# Altium schematic sheet Bias_Current_Source.SchDoc
size 228 x 152 mm
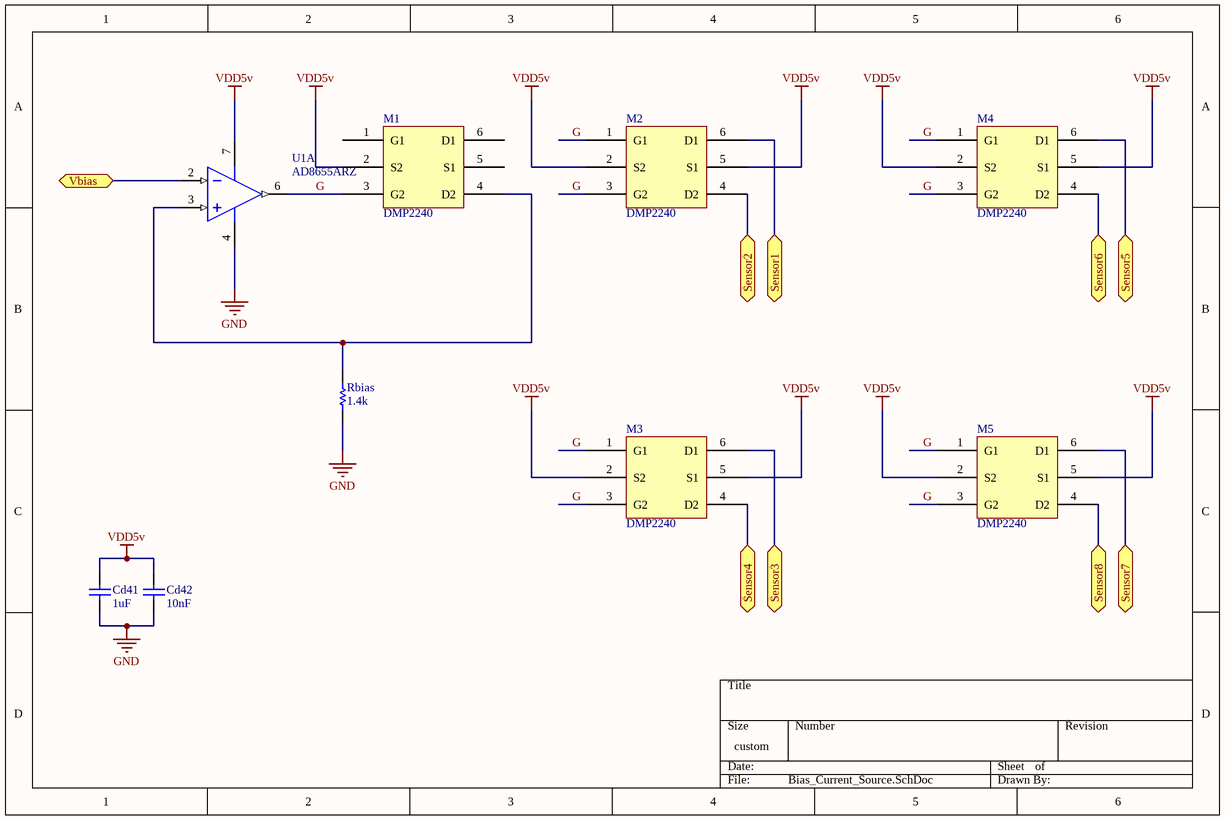
[diagram p0: Bias_Current_Source.SchDoc]

## Parts
Cd41  value 1uF  [1608[0603]]  (hidden comment: Cap)
Cd42  value 10nF  [1608[0603]]  (hidden comment: Cap)
M1  DMP2240  [SO-G6/E2.4]
M2  DMP2240  [SO-G6/E2.4]
M3  DMP2240  [SO-G6/E2.4]
M4  DMP2240  [SO-G6/E2.4]
M5  DMP2240  [SO-G6/E2.4]
Rbias  value 1.4k  [1608[0603]]  (hidden comment: Res1)
U1  AD8655ARZ  [ADI-R-8_N]  (part A of 2)

## Ports
Sensor1 (bidir), Sensor2 (bidir), Sensor3 (bidir), Sensor4 (bidir), Sensor5 (bidir), Sensor6 (bidir), Sensor7 (bidir), Sensor8 (bidir), Vbias (bidir)

## Nets
GND: Cd41.2 Cd42.2 Rbias.2 U1.4(-V)
VDD5v: Cd41.1 Cd42.1 M1.2(S2) M2.2(S2) M2.5(S1) M3.2(S2) M3.5(S1) M4.2(S2) M4.5(S1) M5.2(S2) M5.5(S1) U1.7(+V)
G: M1.3(G2) M2.1(G1) M2.3(G2) M3.1(G1) M3.3(G2) M4.1(G1) M4.3(G2) M5.1(G1) M5.3(G2) U1.6(OUT)
Sensor1: M2.6(D1) ; port Sensor1
Sensor2: M2.4(D2) ; port Sensor2
Sensor3: M3.6(D1) ; port Sensor3
Sensor4: M3.4(D2) ; port Sensor4
Sensor5: M4.6(D1) ; port Sensor5
Sensor6: M4.4(D2) ; port Sensor6
Sensor7: M5.6(D1) ; port Sensor7
Sensor8: M5.4(D2) ; port Sensor8
Vbias: U1.2(-IN) ; port Vbias
NetM1_4: M1.4(D2) Rbias.1 U1.3(+IN)

Not connected (* = marked no-connect by the designer): M1 1(G1) 5(S1) 6(D1)

## Library data of the parts
Cd41 Cd42 = Cap: Capacitor; Published: 8-Jun-2000; LatestRevisionDate: 17-Jul-2002; LatestRevisionNote: Re-released for DXP Platform.; PackageReference: RAD-0.3; Publisher: Altium Limited; PackageDescription: Radial Cap, Thru-Hole; 2 Leads; 0.3 in Pin Spacing; Digi-Key: 445-7534-1-ND
Rbias = Res1: Resistor; Published: 8-Jun-2000; LatestRevisionDate: 17-Jul-2002; LatestRevisionNote: Re-released for DXP Platform.; PackageReference: AXIAL-0.3; Publisher: Altium Limited; PackageDescription: Axial Device, Thru-Hole; 2 Leads; 0.3 in Pin Spacing; Digikey PN: P1.00KCCT-ND
U1 = AD8655ARZ: Single Channel Low Offset Voltage Operational Amplifier, 28 MHz BW, 11 V/us SR, Industrial, 8-pin SOIC (R-8), Tube; Generic Part Number: AD8655; Manufacturer: Analog Devices; Amplifiers Per Package: 1; Input Bias Current: 1pA; Input Offset Voltage: 50uV; Iq/Amp: 4.5mA; Slew Rate: 11V/us; Small Signal Bandwidth: 28MHz; V Span Max: 5.5V; V Span Min: 2.7V; DatasheetVersion: Rev. B; PackageVersion: 060506-A; PackageReference: R-8; PackageDescription: 8-Pin Standard Small Outline Package, Body 3.9 x 4.9 mm, Pitch 1.27 mm; Supplier 1: Digi-Key; Supplier Part Number 1: AD8655ARZ-ND; Supplier 2: Newark; Supplier Part Number 2: 59K7052; Mounting Technology: Surface Mount; Code_JEDEC: MS-012-AA; PartNumber: AD8655ARZ; ComponentLink1Description: Manufacturer URL; ComponentLink1URL: http://www.analog.com/en/index.html; ComponentLink2Description: Datasheet; ComponentLink2URL: http://www.analog.com/static/imported-files/data_sheets/AD8655_8656.pdf; ComponentLink3Description: Package Specification; ComponentLink3URL: http://www.analog.com/static/imported-files/packages/PKG_PDF/SOIC_Narrow%20(R)/R_8.pdf; ComponentLink4Description: Reference Circuit; ComponentLink4URL: http://www.analog.com/en/all-operational-amplifiers-op-amps/operational-amplifiers-op-amps/ad8655/products/product.html#product-recommendations